# EAGLE design speaker-board (EAGLE 9.1.0)
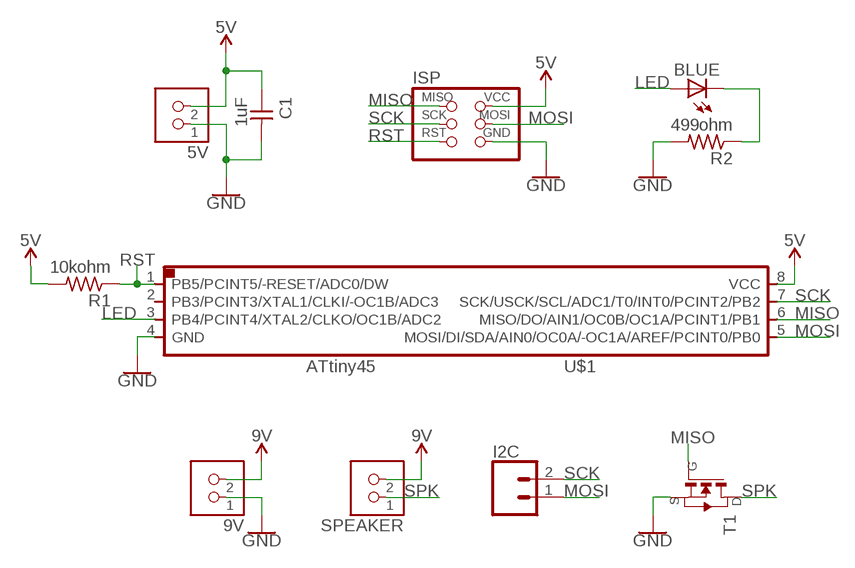
[diagram p0: schematic, sheet 1]

## Parts
5V  TERM-1X02-FABLAB  [ED555DS-2DS]
9V  TERM-1X02-FABLAB  [ED555DS-2DS]
BLUE  LEDFAB1206  [LED1206FAB]
C1  1uF  CAP-UNPOLARIZEDFAB  [C1206FAB]
I2C  CONN_021X02_NO_SILK  [1X02_NO_SILK]
ISP  AVRISPSMD  [2X03SMD]
R1  10kohm  RES-US1206FAB  [R1206FAB]
R2  499ohm  RES-US1206FAB  [R1206FAB]
SPEAKER  TERM-1X02-FABLAB  [ED555DS-2DS]
T1  NMOSFETSOT23  [SOT-23]
U$1  ATTINY45SI  [SOIC8]

## Nets
GND: 5V.1 9V.1 C1.2 ISP.6(GND) R2.2 T1.2(S) U$1.4(GND)
LED: BLUE.1(A) U$1.3(PB4/PCINT4/XTAL2/CLKO/OC1B/ADC2)
MISO: ISP.1(MISO) T1.3(G) U$1.6(MISO/DO/AIN1/OC0B/OC1A/PCINT1/PB1)
MOSI: I2C.1 ISP.4(MOSI) U$1.5(MOSI/DI/SDA/AIN0/OC0A/-OC1A/AREF/PCINT0/PB0)
N$2: BLUE.2(C) R2.1
RST: ISP.5(RST) R1.1 U$1.1(PB5/PCINT5/-RESET/ADC0/DW)
SCK: I2C.2 ISP.3(SCK) U$1.7(SCK/USCK/SCL/ADC1/T0/INT0/PCINT2/PB2)
SPK: SPEAKER.1 T1.1(D)
VCC_1: 5V.2 C1.1 ISP.2(VCC) R1.2 U$1.8(VCC) ; supply symbol labelled 5V
VCC_2: 9V.2 SPEAKER.2 ; supply symbol labelled 9V
Unconnected: U$1.2(PB3/PCINT3/XTAL1/CLKI/-OC1B/ADC3)

## Library data of the parts
5V 9V SPEAKER = fab:TERM-1X02: 3.5mm terminal block, 2 positions ED555-2DS as found in the fablab inventory. Stolen from Adafruit <http://www.ladyada.net/library/pcb/eaglelibrary.html>, adapted by Zaerc.
BLUE = fab:LED: LED
C1 = fab:CAP-UNPOLARIZED
I2C = SparkFun-Connectors:CONN_02: Multi connection point. Often used as Generic Header-pin footprint for 0.1 inch spaced/style header connections On any of the 0.1 inch spaced packages, you can populate with these: Break Away Headers - Straight <https://www.sparkfun.com/products/116> (PRT-00116) Break Away Male Headers - Right Angle <https://www.sparkfun.com/products/553> (PRT-00553) Female Headers <https://www.sparkfun.com/products/115> (PRT-00115) Break Away Headers - Machine Pin <https://www.sparkfun.com/products/117> (PRT-00117) Break Away Female Headers - Swiss Machine Pin <https://www.sparkfun.com/products/743> (PRT-00743) For SCREWTERMINALS and SPRING TERMINALS visit here: Screw Terimnals on SparkFun.com <https://www.sparkfun.com/search/results?term=Screw+Terminals> (5mm/3.5mm/2.54mm spacing) This device is also useful as a general connection point to wire up your design to another part of your project. Our various solder wires solder well into these plated through hole pads. Hook-Up Wire - Assortment (Stranded, 22 AWG) <https://www.sparkfun.com/products/11375> (PRT-11375) Hook-Up Wire - Assortment (Solid Core, 22 AWG) <https://www.sparkfun.com/products/11367> (PRT-11367) View the entire wire category on our website here <https://www.sparkfun.com/categories/141> Special notes: Molex polarized connector foot print use with: PRT-08233 with associated crimp pins and housings. 2.54_SCREWTERM for use with PRT-10571. 3.5mm Screw Terminal footprints for PRT-08084 5mm Screw Terminal footprints for use with PRT-08432
ISP = fab:AVRISP
R1 R2 = fab:RES-US: Resistor (US Symbol) Variants with postfix FAB are widened to allow the routing of internal traces
T1 = fab:NMOSFET: MOS FET
U$1 = fab:ATTINY45

## Board
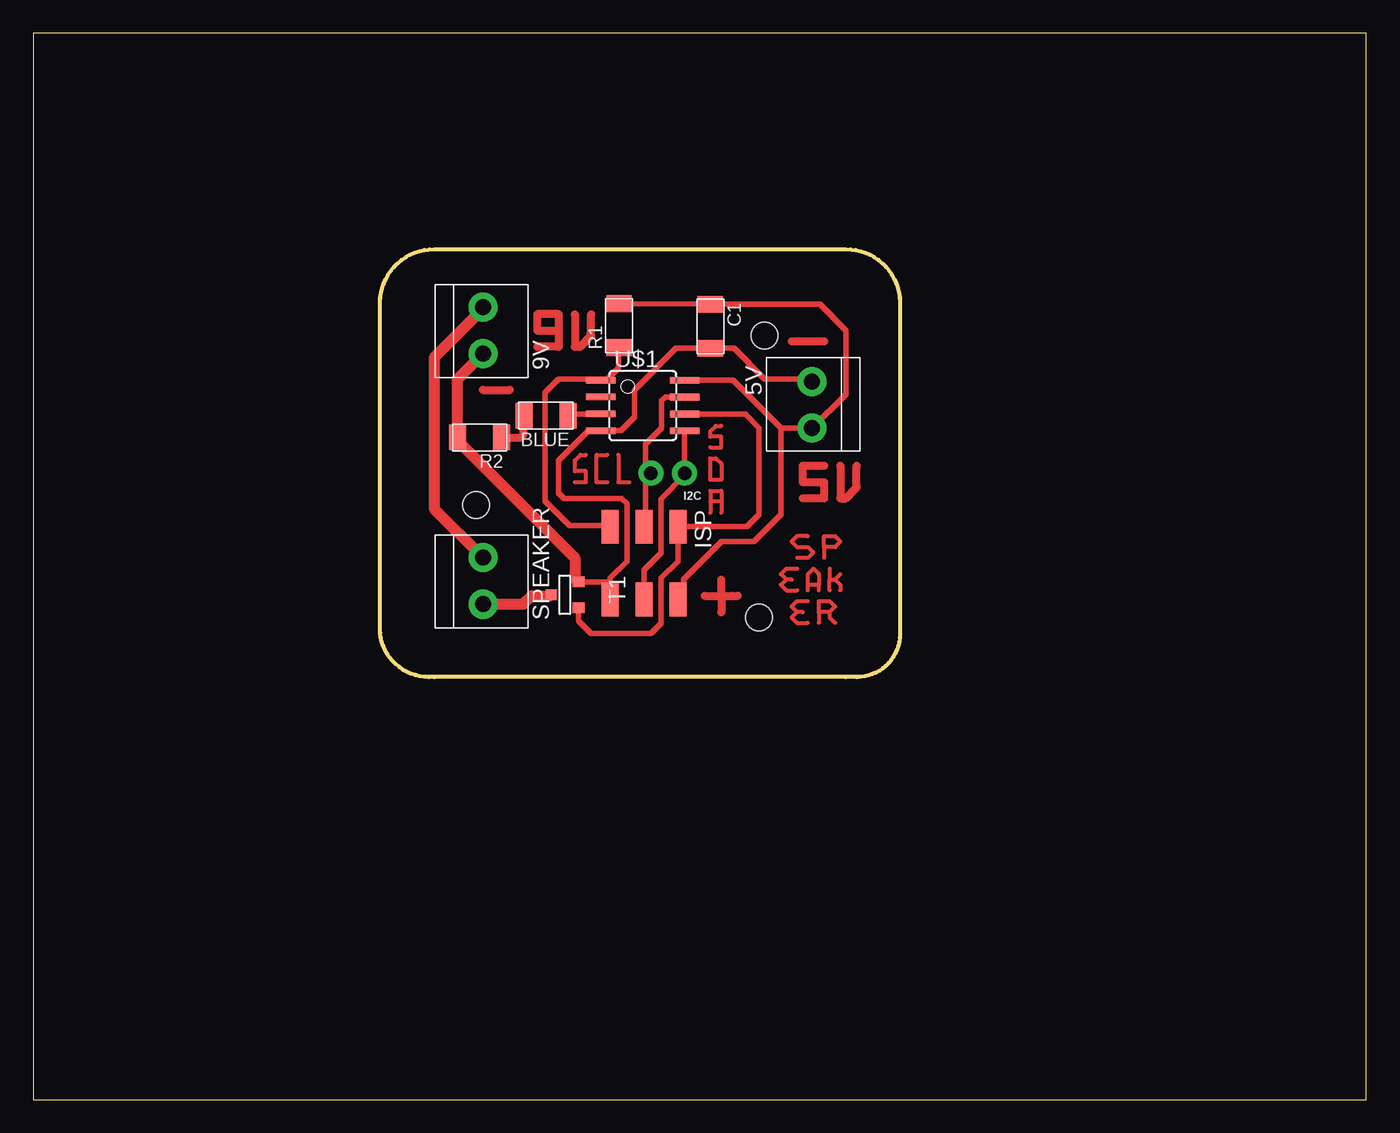
[diagram p1: board, top side]

Size 100 x 80 mm. Coordinates in mm from the lower left corner, seen from the top.
Outline: 0,0 100,0 100,80 0,80 0,0
Copper layers (1*16): Top 0.035mm / dielectric 1.5mm / Bottom 0.035mm
Design rules "default *": minimum track width 10mil, minimum drill 24mil, track to track 16mil, track to pad 16mil, pad to pad 16mil, via to via 16mil, smd to smd 16mil, copper to edge 40mil, drill to drill 8mil, minimum pad ring 10mil, minimum via ring 8mil, stop-mask expansion 4mil, vias tented up to drill 0mil, thermal gap 10mil
Holes 2 mm at 33.22,44.6 54.46,36.17 54.86,57.3
Milling: area 26,31.7 to 65,63.8

### Footprints (pad centres in the part's own frame; a part is rotated, then mirrored left to right if it is on the bottom)
ED555DS-2DS = drill 1.2 pad 2.184: 1 1.8,0; 2 -1.7,0
LED1206FAB = smd 1.27 x 1.905: 1 -1.651,0; 2 1.651,0
C1206FAB = smd 1.27 x 1.905: 1 -1.651,0; 2 1.651,0
1X02_NO_SILK = drill 1.016 pad 1.88: 1 0,0; 2 2.54,0
2X03SMD = smd 2.54 x 1.27: 1 -2.54,2.54; 2 2.92,2.54; 3 -2.54,0; 4 2.92,0; 5 -2.54,-2.54; 6 2.92,-2.54
R1206FAB = smd 1.27 x 1.905: 1 -1.651,0; 2 1.651,0
SOT-23 = smd 0.787 x 0.889: 1 0.025,-1.016; 2 -0.94,1.016; 3 0.991,1.016
SOIC8 = smd 0.5 x 2.2: 1 -1.905,-3.154; 2 -0.645,-3.154; 3 0.625,-3.154; 4 1.895,-3.154; 5 1.905,3.154; 6 0.635,3.154; 7 -0.635,3.154; 8 -1.905,3.154

### Placement (x,y rotation side)
5V  58.42,52.07 90 top
9V  33.73,57.76 270 top
BLUE  38.46,51.31 180 top
C1  50.8,58.01 270 top
I2C  48.87,46.99 180 top
ISP  45.82,40.44 270 top
R1  43.94,58.06 90 top
R2  33.48,49.68 180 top
SPEAKER  33.73,38.96 270 top
T1  39.88,37.9 270 top
U$1  45.72,52.07 270 top

### Tracks (layer width: path | path; a pad name or v marks a point on that pad's centre or on a via)
GND
  Top 0.406: 5V.1 58.24,54.05 54.86,54.05 52.55,56.36 C1.2 48.23,56.36 45.11,53.24 45.11,51.21 44.09,50.19 42.58,50.19 | 42.58,50.19 U$1.4 | ISP.6 43.28,38.61 | 43.28,38.61 43.28,39.12 44.55,40.39 44.55,44.7 44.15,45.11 39.83,45.11 39.42,45.52 39.42,47.95 41.66,50.19 42.58,50.19 | 43.28,38.61 43.05,38.84 T1.2 41.05,38.99
  Top 0.813: 9V.1 31.83,54.05 R2.2 31.83,49.45 40.64,40.64 40.64,39.09 T1.2
LED
  Top 0.406: U$1.3 40.04,51.45 BLUE.1
MISO
  Top 0.406: U$1.6 53.42,51.44 54.46,50.39 54.46,43.89 53.54,42.98 ISP.1 48.36,40.39 47.09,39.12 47.09,35.71 46.33,34.95 41.86,34.95 40.89,35.92 T1.3
MOSI
  Top 0.406: ISP.4 45.82,39.73 47.09,41 47.09,45.06 48.87,46.84 I2C.1 | U$1.5 I2C.1 | I2C.1
N$1
  Top 0.61: 59.33,47.55 57.71,47.55 57.71,46.33 59.33,46.33 59.33,45.11 57.71,45.11
N$2
  Top 0.61: R2.1 36.58,49.68 36.78,49.89 36.78,51.28 BLUE.2
N$3
  Top 0.61: 60.55,47.55 60.55,45.11 60.96,45.11 61.77,45.92 61.77,47.55
N$4
  Top 0.61: 39.42,57.71 37.8,57.71 37.8,58.93 39.42,58.93 39.42,57.71 | 39.42,57.71 39.42,56.49 37.8,56.49
N$5
  Top 0.61: 40.64,58.93 40.64,56.49 41.05,56.49 41.86,57.3 41.86,58.93
N$6
  Top 0.305: 50.8,44.86 50.8,45.67 51.61,45.67 51.61,44.86 | 50.8,44.86 50.8,44.04 | 51.61,44.86 51.61,44.04 | 51.61,44.86 50.8,44.86
N$7
  Top 0.61: 50.39,37.8 51.61,37.8 | 51.61,37.8 52.43,37.8 52.83,37.8 | 51.61,37.8 51.61,36.58 | 51.61,37.8 51.61,39.01
N$8
  Top 0.61: 56.9,56.9 59.33,56.9
N$9
  Top 0.61: 33.73,53.24 35.76,53.24
N$10
  Top 0.305: 40.64,46.33 41.45,46.33 41.45,47.14 40.64,47.14 40.64,47.95 41.05,48.36 41.45,48.36
N$11
  Top 0.305: 43.08,48.36 42.27,48.36 42.27,46.33 43.08,46.33
N$12
  Top 0.305: 43.89,48.36 43.89,46.33 44.7,46.33
N$13
  Top 0.305: 50.8,48.92 51.61,48.92 51.61,49.73 50.8,49.73 50.8,50.14 51.21,50.55 51.61,50.55
N$14
  Top 0.305: 50.8,46.48 50.8,48.11 51.21,48.11 51.61,47.7 51.61,46.48 50.8,46.48
N$15
  Top 0.305: 58.12,42.27 57.3,42.27 56.9,41.86 57.3,41.45 58.12,41.45 58.52,41.05 58.12,40.64 57.3,40.64
N$16
  Top 0.305: 59.33,41.45 60.15,41.45 60.55,41.86 60.15,42.27 59.33,42.27 59.33,41.45 | 59.33,41.45 59.33,40.64
N$17
  Top 0.305: 57.3,39.83 56.49,39.83 56.08,39.42 56.49,39.01 | 56.9,39.01 56.49,39.01 | 56.49,39.01 56.08,38.61 56.49,38.2 57.3,38.2
N$18
  Top 0.305: 58.12,38.2 58.12,38.61 | 58.12,38.61 58.12,39.42 58.52,39.83 58.93,39.42 58.93,38.61 | 58.93,38.2 58.93,38.61 | 58.93,38.61 58.12,38.61
N$19
  Top 0.305: 59.74,39.83 59.74,39.01 | 59.74,38.2 59.74,39.01 | 59.74,39.01 60.15,39.01 | 60.55,39.42 60.15,39.01 | 60.15,39.01 60.55,38.61 60.55,38.2
N$20
  Top 0.305: 58.12,37.39 57.3,37.39 56.9,36.98 57.3,36.58 | 57.71,36.58 57.3,36.58 | 57.3,36.58 56.9,36.17 57.3,35.76 58.12,35.76
N$21
  Top 0.305: 59.74,36.58 60.15,36.98 59.74,37.39 58.93,37.39 58.93,36.58 | 59.74,36.58 58.93,36.58 | 58.93,36.58 58.93,35.76 | 59.74,36.58 59.74,36.17 60.15,35.76
RST
  Top 0.406: ISP.5 43.18,43.08 40.23,43.08 38.41,44.91 38.41,53.03 39.42,54.05 42.49,54.05 | 42.49,54.05 U$1.1 | 42.49,54.05 43.08,54.05 43.89,54.86 43.89,56.36 R1.1
SCK
  Top 0.406: U$1.7 47.42,52.7 47.14,52.43 47.14,50.39 45.92,49.17 45.92,47.4 I2C.2 46.33,46.74 45.92,46.33 45.92,43.08 ISP.3
SPK
  Top 0.813: SPEAKER.1 36.76,37.16 37.39,37.8 38.79,37.8 T1.1
VCC_1
  Top 0.406: R1.2 50.77,59.69 C1.1 59,59.66 60.96,57.71 60.96,52.91 5V.2 58.4,50.39 56.08,50.39 | U$1.8 52.5,53.98 56.08,50.39 | 56.08,50.39 56.08,43.89 54.05,41.86 51.61,41.86 48.77,39.01 48.77,37.92 ISP.2
VCC_2
  Top 0.406: 9V.2 33.73,59.33
  Top 0.813: 33.73,59.33 30.07,55.68 30.07,44.32 SPEAKER.2